# Altium schematic sheet 13-Fusing.SchDoc
size A4
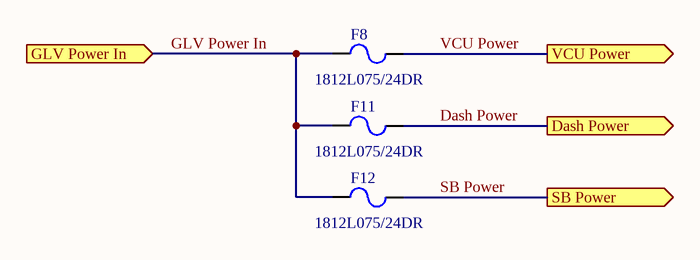
[diagram p0: 13-Fusing.SchDoc]

## Parts
F8  1812L075/24DR  [LFUS-1812L07524DR_V]
F11  1812L075/24DR  [LFUS-1812L07524DR_V]
F12  1812L075/24DR  [LFUS-1812L07524DR_V]

## Ports
Dash Power (out), GLV Power In (in), SB Power (out), VCU Power (out)

## Nets
Dash Power: F11.2 ; port Dash Power
GLV Power In: F8.1 F11.1 F12.1 ; port GLV Power In
SB Power: F12.2 ; port SB Power
VCU Power: F8.2 ; port VCU Power

## Library data of the parts
F8 F11 F12 = CMP-2000-05510-1: Poly-Fuse(R) Resettable PTC, 24 V, 100 A, -40 to 85 degC, 2-Pin SMD, RoHS, Tape and Reel; Manufacturer: Littelfuse; Resistance: 290mOhms; Current Rating - Max: 100A; Maximum Voltage: 24VDC; Hold Current: 0.75A; Trip Current: 1.5A; Maximum Voltage DC: 24V; Type: PolyFuseResettablePTC; Datasheet Version: 02/2016; Package / Case: 1812(4532metric); Mounting Technology: SurfaceMount; Packaging: Reel; Package Description: 2-Pin Surface Mount Device, Body 4.55 x 3.24 mm; Brand: Littelfuse; Manufacturer URL: http://www.littelfuse.com/; Mounting Style: SMD/SMT; Dimensions: 4.37mmLx3.07mmWx0.75mmH; Operating Temperature Range: -40Cto+85C; Product Category: ResettableFuses-PPTC; Current Rating: 100A; Termination Style: SMD/SMT; Factory Pack Quantity: 1500; Current Rating (Max): 100A; Package Reference: 1812L07524DR; RoHS: Details; Series: 1812L; Datasheet URL: http://www.littelfuse.com/~/media/electronics/datasheets/resettable_ptcs/littelfuse_ptc_1812l_datasheet.pdf.pdf